# Altium schematic sheet Button.SchDoc
size A
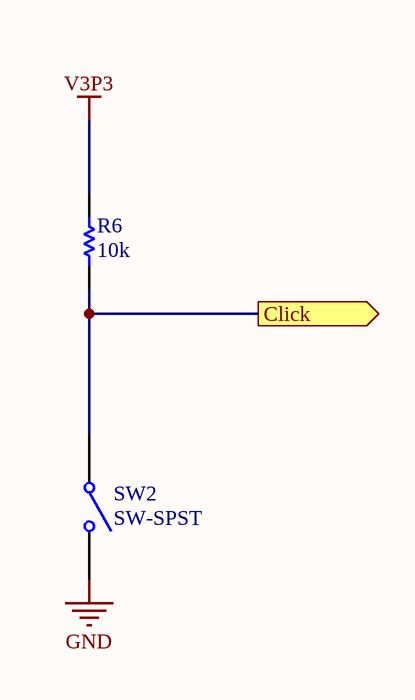
[diagram p0: Button.SchDoc]

## Parts
R6  10k  [RES 0603]
SW2  SW-SPST  [SWITCH]

## Ports
Click (out)

## Nets
GND: SW2.2(NO)
V3P3: R6.2
Click: R6.1 SW2.1(COMMON) ; port Click

## Library data of the parts
R6 = Res1: Resistor; PackageReference: AXIAL-0.3; PackageDescription: Axial Device, Thru-Hole; 2 Leads; 0.3 in Pin Spacing; Value: 10k
SW2 = SW-SPST: Single-Pole, Single-Throw Switch; Fournisseur: Farnell; Fabricant: ALCOSWITCH - TE CONNECTIVITY; RefFabricant: 1437566-3; RefFournisseur: 2468741; PackageReference: SPST-2; PackageDescription: Switch; 2 Leads